# EAGLE design Shruthi-Analog-IR3109-v01 (EAGLE 5.09)
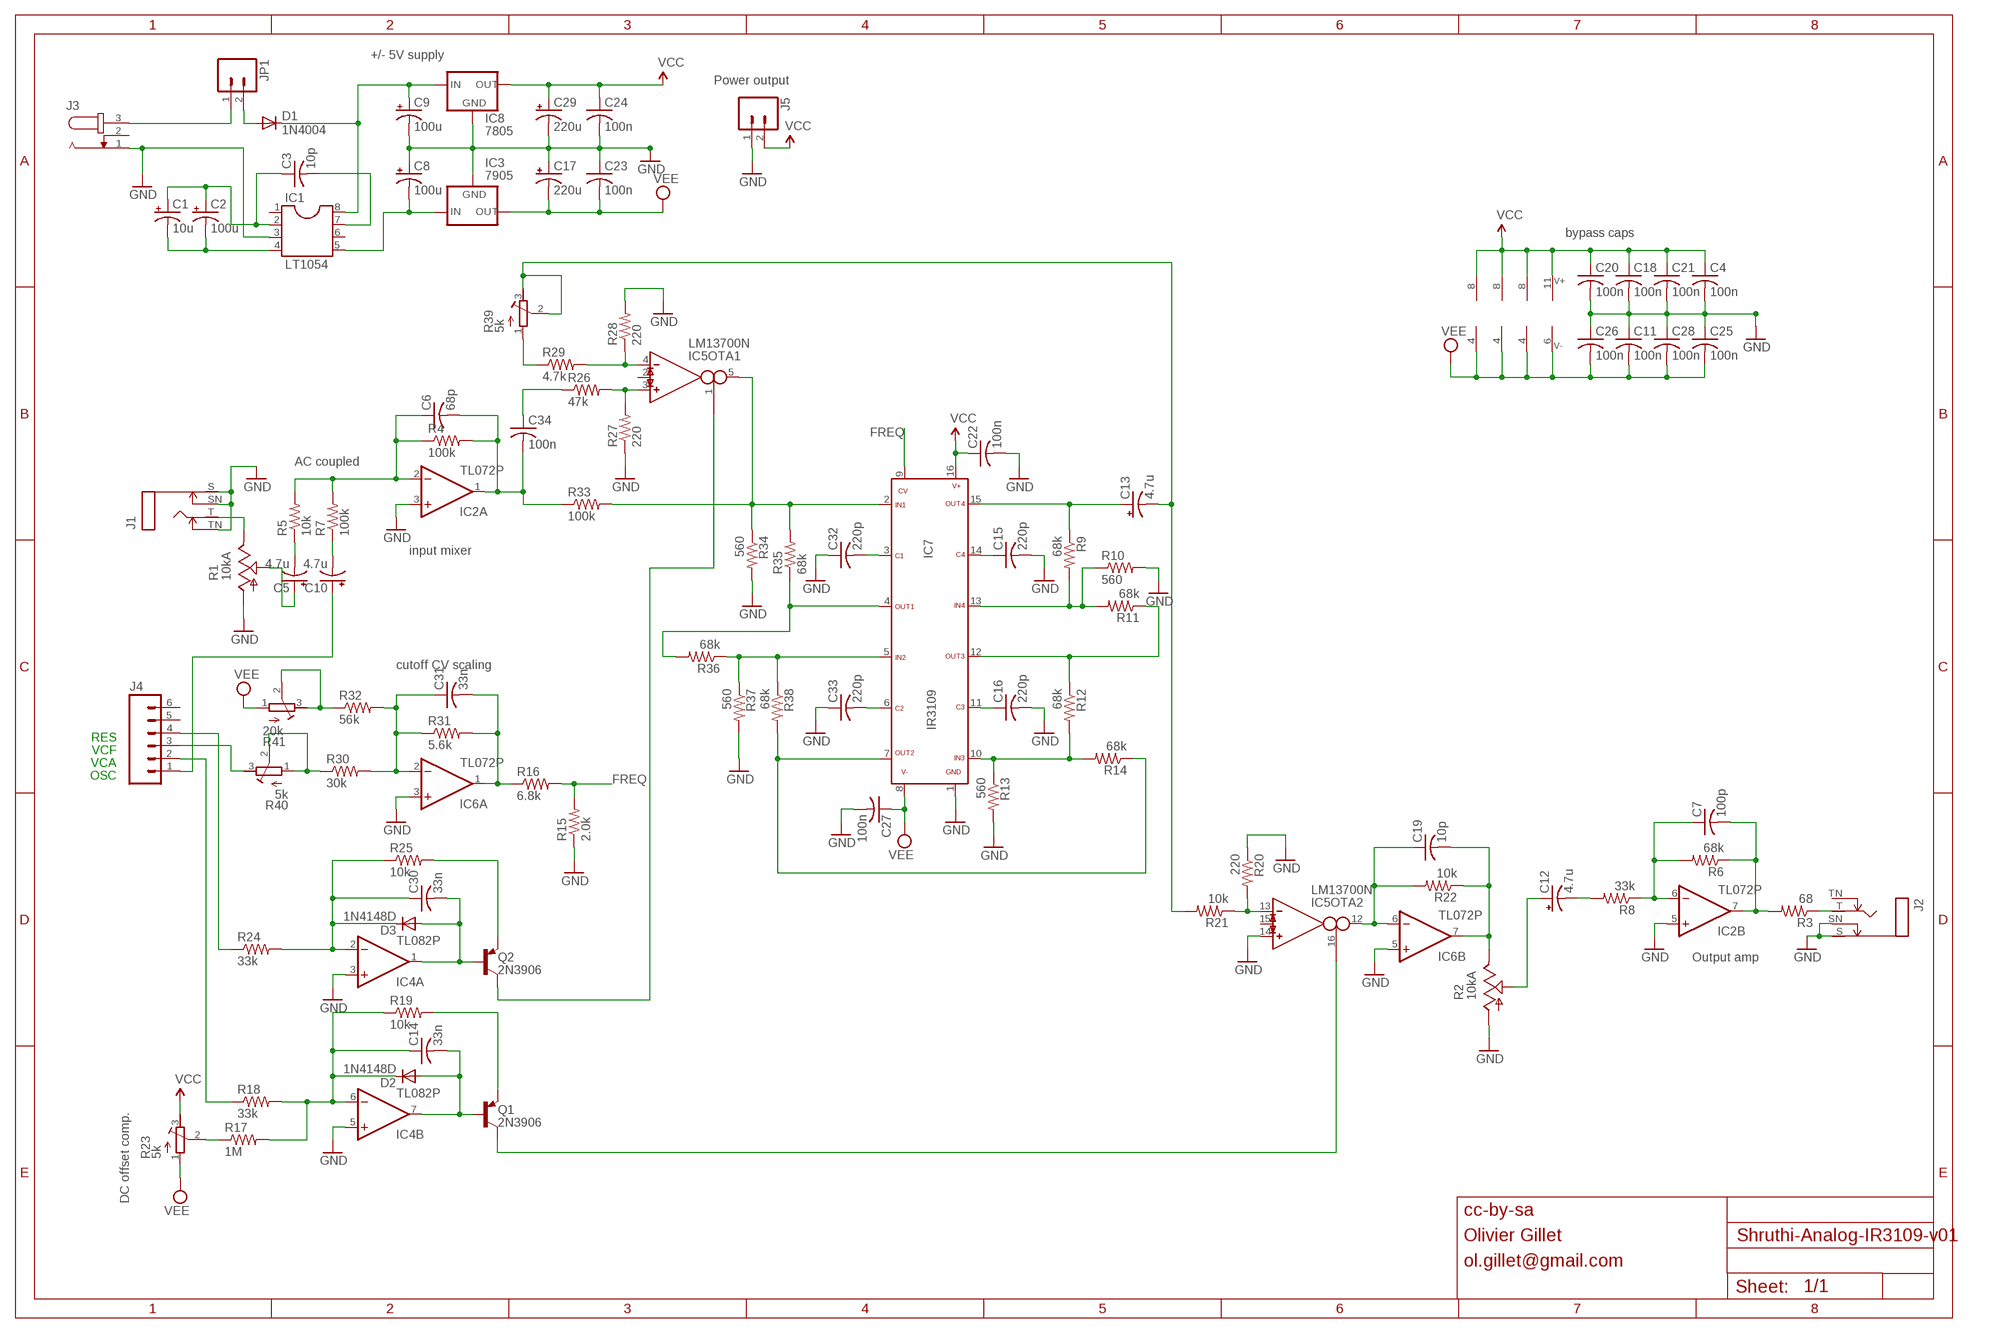
[diagram p0: schematic, sheet 1]

## Parts
C1  10u  CPOL-USE2.5-5  [E2,5-5]
C2  100u  CPOL-USE2.5-6  [E2,5-6]
C3  10p  C-US025-025X050  [C025-025X050]
C4  100n  C-US025-025X050  [C025-025X050]
C5  4.7u  CPOL-USE2.5-6  [E2,5-6]
C6  68p  C-US025-025X050  [C025-025X050]
C7  100p  C-US025-025X050  [C025-025X050]
C8  100u  CPOL-USE2.5-7  [E2,5-7]
C9  100u  CPOL-USE2.5-7  [E2,5-7]
C10  4.7u  CPOL-USE2.5-6  [E2,5-6]
C11  100n  C-US025-025X050  [C025-025X050]
C12  4.7u  CPOL-USE2.5-6  [E2,5-6]
C13  4.7u  CPOL-USE2.5-6  [E2,5-6]
C14  33n  C-US050-025X075  [C050-025X075]
C15  220p  C-US025-040X050  [C025-040X050]
C16  220p  C-US025-040X050  [C025-040X050]
C17  220u  CPOL-USE5-10.5  [E5-10,5]
C18  100n  C-US025-025X050  [C025-025X050]
C19  10p  C-US025-025X050  [C025-025X050]
C20  100n  C-US025-025X050  [C025-025X050]
C21  100n  C-US025-025X050  [C025-025X050]
C22  100n  C-US025-025X050  [C025-025X050]
C23  100n  C-US025-025X050  [C025-025X050]
C24  100n  C-US025-025X050  [C025-025X050]
C25  100n  C-US025-025X050  [C025-025X050]
C26  100n  C-US025-025X050  [C025-025X050]
C27  100n  C-US025-025X050  [C025-025X050]
C28  100n  C-US025-025X050  [C025-025X050]
C29  220u  CPOL-USE5-10.5  [E5-10,5]
C30  33n  C-US050-025X075  [C050-025X075]
C31  33n  C-US050-025X075  [C050-025X075]
C32  220p  C-US025-040X050  [C025-040X050]
C33  220p  C-US025-040X050  [C025-040X050]
C34  100n  C-US025-025X050  [C025-025X050]
D1  1N4004  [DO41-10]
D2  1N4148D  DIODE-D-5  [D-5]
D3  1N4148D  DIODE-D-5  [D-5]
IC1  LT1054  DIL8  [DIL08]
IC2  TL072P  [DIL08]
IC3  7905  79XXS  [79XXS]
IC4  TL082P  TL072P  [DIL08]
IC5  LM13700N  [DIL16]
IC6  TL072P  [DIL08]
IC7  IR3109  [DIL16]
IC8  7805  78XXS  [78XXS]
J1  MONOSWS  [NMJ4HC-S]
J2  MONOSWS  [NMJ4HC-S]
J3  JACK-PLUG1  [SPC4078]
J4  M06SIP  [1X06]
J5  M02PTH  [1X02]
JP1  M02  [1X02_LONGPADS]
Q1  2N3906  2N3906-  [TO92-]
Q2  2N3906  2N3906-  [TO92-]
R1  10kA  POT_USCABLED  [CABLE_POT_6MM]
R2  10kA  POT_USCABLED  [CABLE_POT_6MM]
R3  68  R-US_0204/7  [0204/7]
R4  100k  R-US_0204/7  [0204/7]
R5  10k  R-US_0204/7  [0204/7]
R6  68k  R-US_0204/7  [0204/7]
R7  100k  R-US_0204/7  [0204/7]
R8  33k  R-US_0204/7  [0204/7]
R9  68k  R-US_0204/7  [0204/7]
R10  560  R-US_0204/7  [0204/7]
R11  68k  R-US_0204/7  [0204/7]
R12  68k  R-US_0204/7  [0204/7]
R13  560  R-US_0204/7  [0204/7]
R14  68k  R-US_0204/7  [0204/7]
R15  2.0k  R-US_0204/7  [0204/7]
R16  6.8k  R-US_0204/7  [0204/7]
R17  1M  R-US_0204/7  [0204/7]
R18  33k  R-US_0204/7  [0204/7]
R19  10k  R-US_0204/7  [0204/7]
R20  220  R-US_0204/7  [0204/7]
R21  10k  R-US_0204/7  [0204/7]
R22  10k  R-US_0204/7  [0204/7]
R23  5k  R-TRIMM3296W  [RTRIM3296W]
R24  33k  R-US_0204/7  [0204/7]
R25  10k  R-US_0204/7  [0204/7]
R26  47k  R-US_0204/7  [0204/7]
R27  220  R-US_0204/7  [0204/7]
R28  220  R-US_0204/7  [0204/7]
R29  4.7k  R-US_0204/7  [0204/7]
R30  30k  R-US_0204/7  [0204/7]
R31  5.6k  R-US_0204/7  [0204/7]
R32  56k  R-US_0204/7  [0204/7]
R33  100k  R-US_0204/7  [0204/7]
R34  560  R-US_0204/7  [0204/7]
R35  68k  R-US_0204/7  [0204/7]
R36  68k  R-US_0204/7  [0204/7]
R37  560  R-US_0204/7  [0204/7]
R38  68k  R-US_0204/7  [0204/7]
R39  5k  R-TRIMM3296W  [RTRIM3296W]
R40  5k  R-TRIMM3296W  [RTRIM3296W]
R41  20k  R-TRIMM3296W  [RTRIM3296W]

## Nets
FREQ: IC7.9 R15.2 R16.2
GND: C4.2 C8.+ C9.- C11.1 C15.2 C16.2 C17.+ C18.2 C20.2 C21.2 C22.2 C23.1 C24.2 C25.1 C26.1 C27.2 C28.1 C29.- C32.1 C33.1 IC1.3 IC2.3(A:+IN) IC2.5(B:+IN) IC3.GND IC4.3(A:+IN) IC4.5(B:+IN) IC5.14(OTA2:IN_P) IC6.3(A:+IN) IC6.5(B:+IN) IC7.1 IC8.GND J1.S J1.SN J1.TN J2.S J2.SN J3.1 J5.1 R1.A R2.A R10.2 R13.2 R15.1 R20.1 R27.1 R28.2 R34.2 R37.2
I_RESO: IC5.1(OTA1:I_BIAS) Q2.1(C)
N$1: C1.+ C2.+ C3.1 IC1.2
N$2: C16.1 IC7.11
N$3: J3.3 JP1.1
N$4: C9.+ D1.C IC1.8 IC8.IN
N$5: C1.- C2.- IC1.4
N$6: C31.2 IC6.1(A:OUT) R16.1 R31.2
N$7: IC5.4(OTA1:IN_N) R28.1 R29.2
N$8: C32.2 IC7.3
N$9: IC5.13(OTA2:IN_N) R20.2 R21.1
N$10: IC5.3(OTA1:IN_P) R26.2 R27.2
N$11: C13.+ IC7.15 R9.1
N$12: IC5.5(OTA1:OUT) IC7.2 R33.2 R34.1 R35.2
N$13: IC7.4 R35.1 R36.2
N$14: IC7.5 R36.1 R37.1 R38.1
N$16: IC7.7 R14.1 R38.2
N$17: C33.2 IC7.6
N$18: IC7.12 R11.1 R12.1
N$19: C12.+ R2.S
N$20: IC7.10 R12.2 R13.1 R14.2
N$21: C15.1 IC7.14
N$22: C6.2 C34.2 IC2.1(A:OUT) R4.2 R33.1
N$23: R29.1 R39.1(E)
N$24: IC7.13 R9.2 R10.1 R11.2
N$25: C12.- R8.2
N$26: C13.- R21.2 R39.2(S) R39.3(A)
N$27: C19.1 IC5.12(OTA2:OUT) IC6.6(B:-IN) R22.2
N$28: C19.2 IC6.7(B:OUT) R2.E R22.1
N$29: C34.1 R26.1
N$30: C30.2 D3.A IC4.1(A:OUT) Q2.2(B)
N$31: C14.2 D2.A IC4.7(B:OUT) Q1.2(B)
N$35: C10.+ J4.1
N$36: C3.2 IC1.7
N$37: C6.1 IC2.2(A:-IN) R4.1 R5.2 R7.2
N$38: J1.T R1.E
N$39: C10.- R7.1
N$40: C31.1 IC6.2(A:-IN) R30.2 R31.1 R32.2
N$41: R30.1 R40.1(E) R40.2(S)
N$42: J4.3 R40.3(A)
N$43: R32.1 R41.2(S) R41.3(A)
N$45: J4.2 R18.1
N$47: J2.T R3.1
N$48: J4.4 R24.1
N$50: R17.1 R23.2(S)
N$51: C14.1 D2.C IC4.6(B:-IN) R17.2 R18.2 R19.1
N$57: C30.1 D3.C IC4.2(A:-IN) R24.2 R25.1
N$58: C8.- IC1.5 IC3.IN
N$59: D1.A JP1.2
N$60: Q2.3(E) R25.2
N$63: C7.2 IC2.7(B:OUT) R3.2 R6.1
N$65: IC5.16(OTA2:I_BIAS) Q1.1(C)
N$66: C5.+ R1.S
N$68: Q1.3(E) R19.2
N$70: C7.1 IC2.6(B:-IN) R6.2 R8.1
N$72: C5.- R5.1
VCC: C4.1 C18.1 C20.1 C21.1 C22.1 C24.1 C29.+ IC2.8(P:V+) IC4.8(P:V+) IC5.11(SUPPLY:V+) IC6.8(P:V+) IC7.16 IC8.OUT J5.2 R23.3(A)
VEE: C11.2 C17.- C23.2 C25.2 C26.2 C27.1 C28.2 IC2.4(P:V-) IC3.OUT IC4.4(P:V-) IC5.6(SUPPLY:V-) IC6.4(P:V-) IC7.8 R23.1(E) R41.1(E)
Unconnected: IC1.1 IC1.6 IC5.2(OTA1:I_DIODE) IC5.7(BUF1:B) IC5.8(BUF1:E) IC5.9(BUF2:E) IC5.10(BUF2:B) IC5.15(OTA2:I_DIODE) J2.TN J3.2 J4.5 J4.6

## Notes on the sheet
- +/- 5V supply
- Power output
- bypass caps
- AC coupled
- input mixer
- cutoff CV scaling
- RES
- VCF
- VCA
- OSC
- Output amp
- DC offset comp.
- cc-by-sa
- Olivier Gillet
- ol.gillet@gmail.com

## Library data of the parts
C1 C2 C5 C8-C10 C12 C13 C17 C29 = rcl:CPOL-US: POLARIZED CAPACITOR, American symbol
C3 C4 C6 C7 C11 C14-C16 C18-C28 C30-C34 = rcl:C-US: CAPACITOR, American symbol
D1 = diode:1N4004: DIODE general purpose rectifier, 1 A
D2 D3 = diode:DIODE-: DIODE
IC1 = ic-package:DIL8: Dual In Line / Socket
IC2 IC4 IC6 = gm-ics:TL072: OP AMP
IC3 = v-reg:79XXS: VOLTAGE REGULATOR
IC5 = ota:LM13700: Dual OTA with buffers
IC7 = og-roland:IR3109: 4-pole VCF with VC-controlled resonance
IC8 = v-reg:78XXS: VOLTAGE REGULATOR
J1 J2 = gm-jacks:MONOSW
J3 = con-jack2:JACK-PLUG: DC POWER JACK Power Jack, DC, Right Angle, Through Hole, Rated 5A at 16VDC, PC Terminals Distributor: Farnell (www.Farnell.de) Drawing: 84N1161.pdf / 84N1162.pdf Manufacturer: SPC Technology (www.spctechnology.com) Type: SPC4077 / SPC 4078
J4 = SparkFun:M06: Header 6 Standard 6-pin 0.1" header. Use with straight break away headers (SKU : PRT-00116), right angle break away headers (PRT-00553), swiss pins (PRT-00743), machine pins (PRT-00117), and female headers (PRT-00115). Molex polarized connector foot print use with SKU : PRT-08094 with associated crimp pins and housings. NOTES ON THE VARIANTS LOCK and LOCK_LONGPADS... This footprint was designed to help hold the alignment of a through-hole component (i.e. 6-pin header) while soldering it into place. You may notice that each hole has been shifted either up or down by 0.005 of an inch from it's more standard position (which is a perfectly straight line). This slight alteration caused the pins (the squares in the middle) to touch the edges of the holes. Because they are alternating, it causes a "brace" to hold the component in place. 0.005 has proven to be the perfect amount of "off-center" position when using our standard breakaway headers. Although looks a little odd when you look at the bare footprint, once you have a header in there, the alteration is very hard to notice. Also, if you push a header all the way into place, it is covered up entirely on the bottom side. This idea of altering the position of holes to aid alignment will be further integrated into the Sparkfun Library for other footprints. It can help hold any component with 3 or more connection pins.
J5 JP1 = SparkFun:M02: Header 2 Standard 2-pin 0.1" header. Use with straight break away headers (SKU : PRT-00116), right angle break away headers (PRT-00553), swiss pins (PRT-00743), machine pins (PRT-00117), and female headers (PRT-00115). Molex polarized connector foot print use with SKU : PRT-08233 with associated crimp pins and housings.
Q1 Q2 = gm-trans:2N3906: PNP Transistor
R1 R2 = pot-cable:POT_US
R3-R22 R24-R38 = rcl:R-US_: RESISTOR, American symbol
R23 R39-R41 = rcl:R-TRIMM: Trimm resistor

## Board
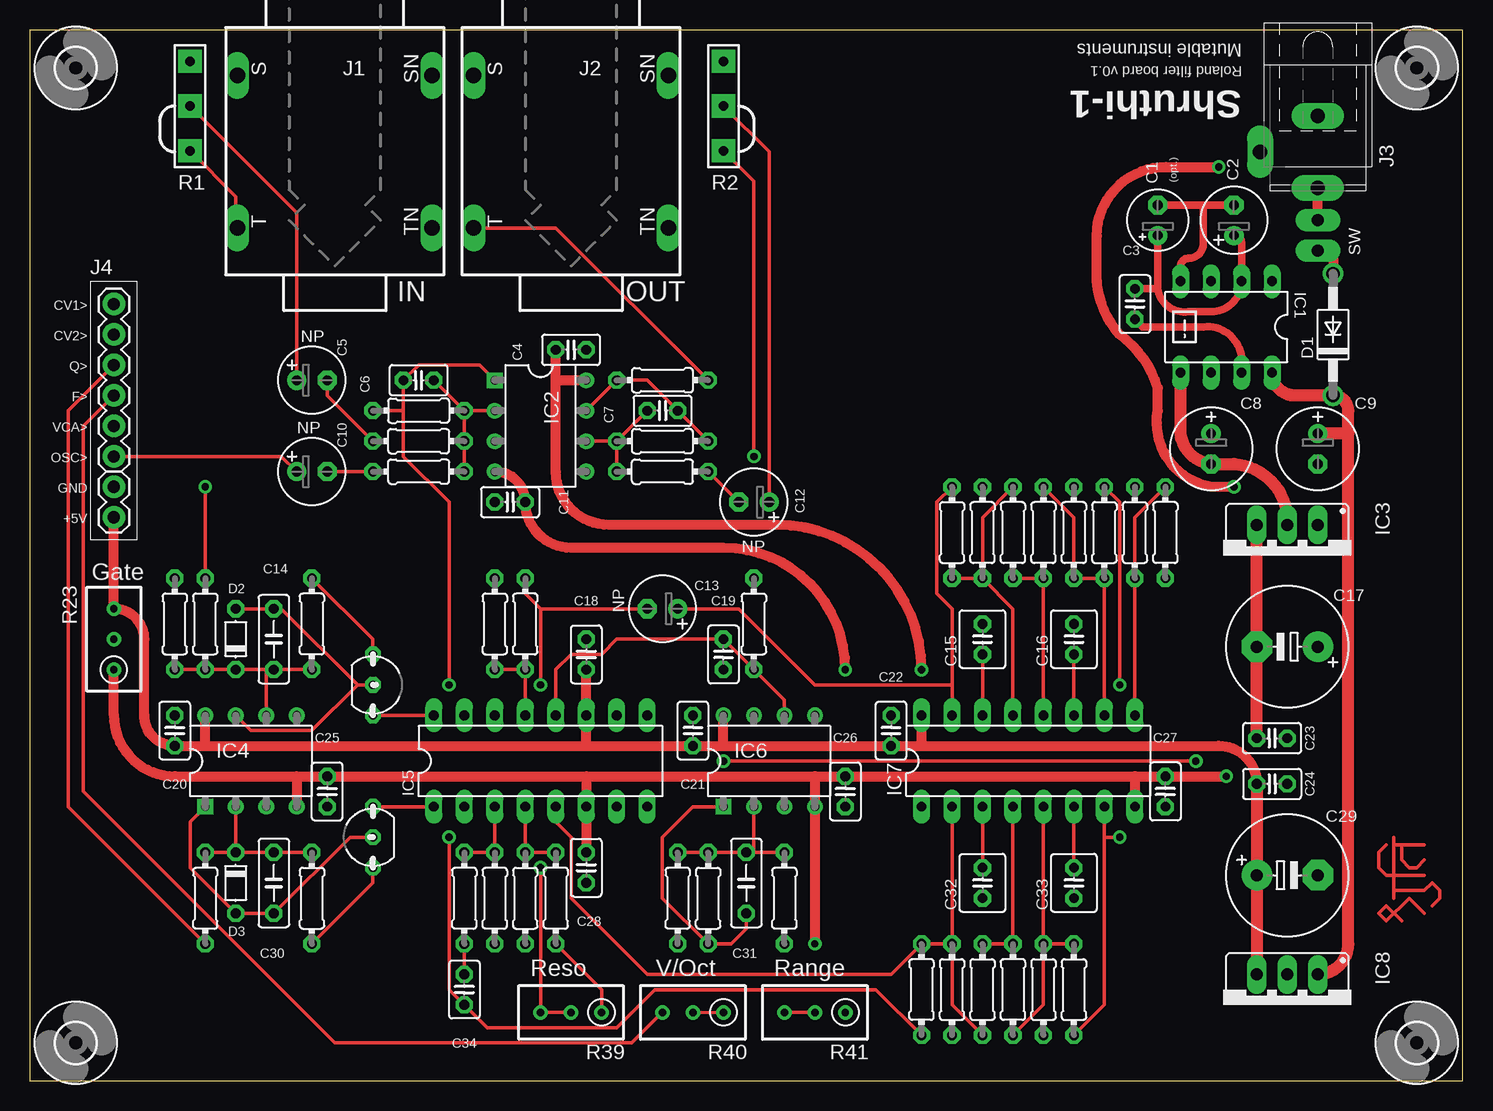
[diagram p1: board, top side]
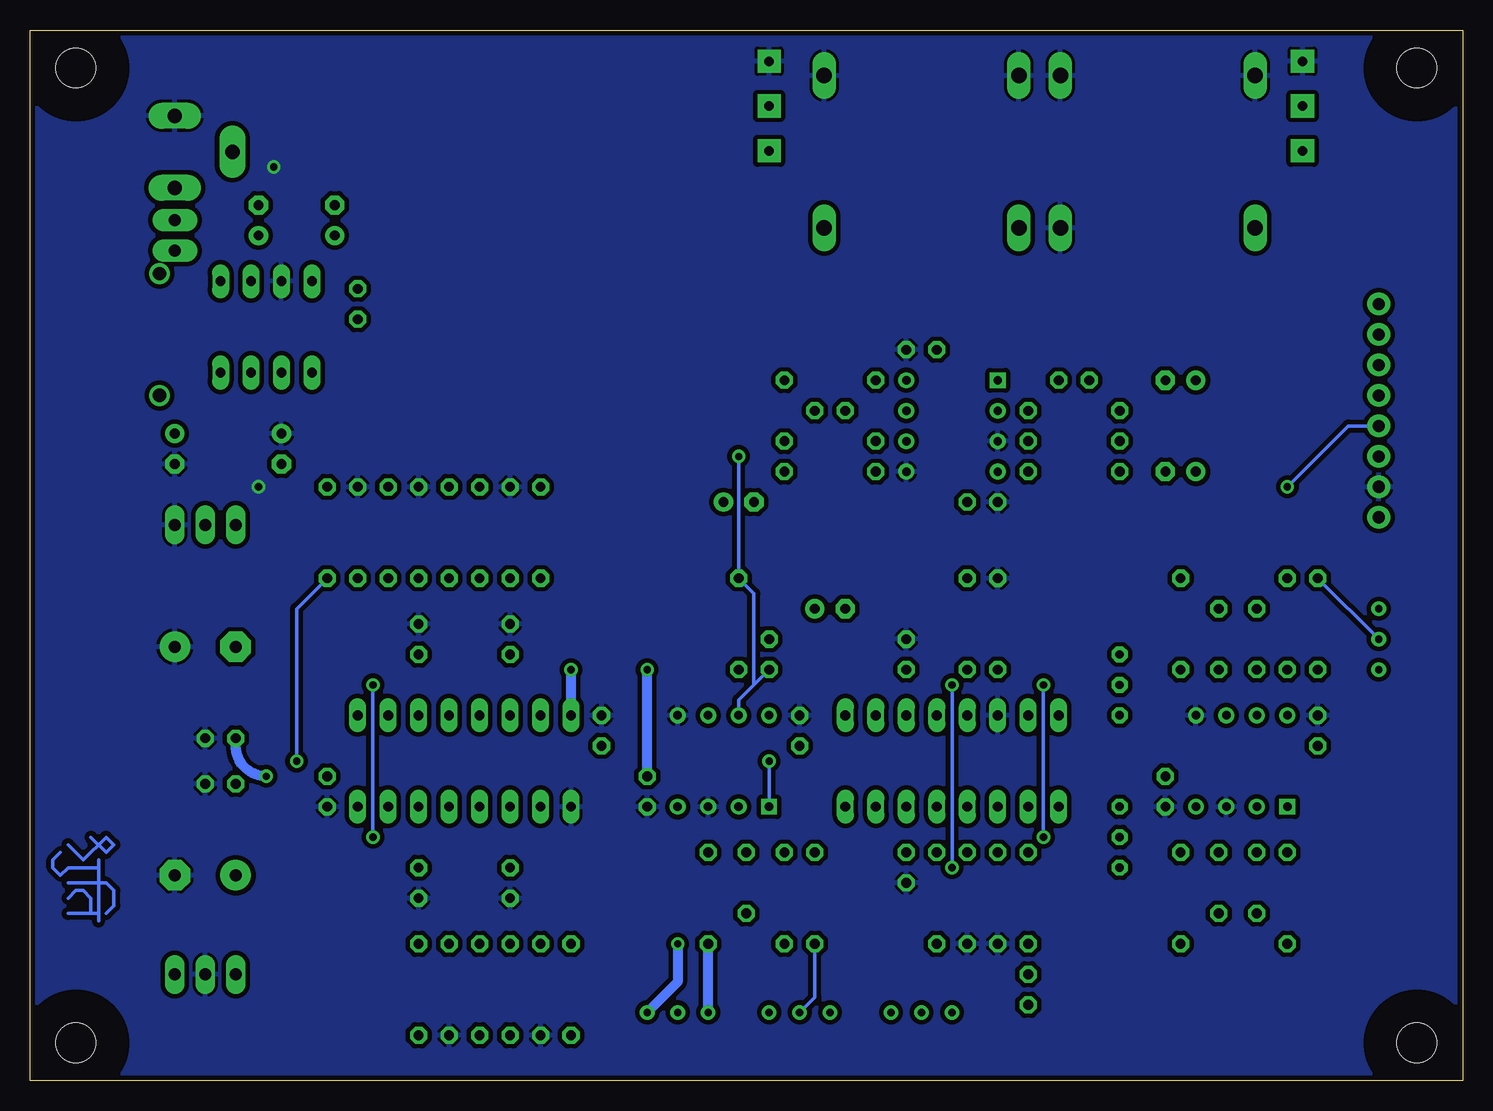
[diagram p2: board, bottom side, seen from below]

Size 119.38 x 87.62 mm. Coordinates in mm from the lower left corner, seen from the top.
Outline: 0,0 119.38,0 119.38,87.62 0,87.62 0,0
Copper layers (1*16): Top 0.035mm / dielectric 1.5mm / Bottom 0.035mm
Design rules "SparkFun_10mil *": minimum track width 10mil, minimum drill 20mil, track to track 10mil, track to pad 10mil, pad to pad 10mil, via to via 10mil, smd to smd 10mil, copper to edge 10mil, drill to drill 10mil, minimum pad ring 12mil, minimum via ring 10mil, stop-mask expansion 4mil, vias tented up to drill 25mil, thermal gap 10mil

### Footprints (pad centres in the part's own frame; a part is rotated, then mirrored left to right if it is on the bottom)
E2,5-5 = drill 0.813 pad 1.6 round: + -1.27,0 | drill 0.813 pad 1.6 octagon: - 1.27,0
E2,5-6 = drill 0.813 pad 1.6 round: + -1.27,0 | drill 0.813 pad 1.6 octagon: - 1.27,0
C025-025X050 = drill 0.813 octagon: 1 -1.27,0; 2 1.27,0
E2,5-7 = drill 0.813 pad 1.6 round: + -1.27,0 | drill 0.813 pad 1.6 octagon: - 1.27,0
C050-025X075 = drill 0.813 octagon: 1 -2.54,0; 2 2.54,0
C025-040X050 = drill 0.813 octagon: 1 -1.27,0; 2 1.27,0
E5-10,5 = drill 1.016 pad 2.54 round: + -2.54,0 | drill 1.016 pad 2.54 octagon: - 2.54,0
DO41-10 = drill 1.118 round: A 5.08,0; C -5.08,0
D-5 = drill 0.813 octagon: A 2.54,0; C -2.54,0
DIL08 = drill 0.813 long: 1 -3.81,-3.81; 2 -1.27,-3.81; 3 1.27,-3.81; 4 3.81,-3.81; 5 3.81,3.81; 6 1.27,3.81; 7 -1.27,3.81; 8 -3.81,3.81
DIL08' = drill 0.7 square: 1 -3.81,-3.81 | drill 0.7 round: 2 -1.27,-3.81; 3 1.27,-3.81; 4 3.81,-3.81; 5 3.81,3.81; 6 1.27,3.81; 7 -1.27,3.81; 8 -3.81,3.81
79XXS = drill 1.016 long: GND -2.54,-2.54; IN 0,-2.54; OUT 2.54,-2.54
DIL16 = drill 0.813 long: 1 -8.89,-3.81; 2 -6.35,-3.81; 3 -3.81,-3.81; 4 -1.27,-3.81; 5 1.27,-3.81; 6 3.81,-3.81; 7 6.35,-3.81; 8 8.89,-3.81; 9 8.89,3.81; 10 6.35,3.81; 11 3.81,3.81; 12 1.27,3.81; 13 -1.27,3.81; 14 -3.81,3.81; 15 -6.35,3.81; 16 -8.89,3.81
78XXS = drill 1.016 long: GND 0,-2.54; IN -2.54,-2.54; OUT 2.54,-2.54
NMJ4HC-S = drill 1.3 long: S 5.08,8.115; SN 5.08,-8.115; T -7.62,8.115; TN -7.62,-8.115
SPC4078_LARGER_HOLES = drill 1.2 pad 2.184 long: 1 -3,0; 2 0,-4.8; 3 3,0
1X06 = drill 1.016 pad 1.88 round: 1 0,0; 2 2.54,0; 3 5.08,0; 4 7.62,0; 5 10.16,0; 6 12.7,0
1X02 = drill 1.016 pad 1.88 round: 1 0,0; 2 2.54,0
1X02_LONGPADS = drill 1.016 pad 1.88 long: 1 0,0; 2 2.54,0
TO92- = drill 0.7 octagon: 1 2.54,0; 2 0,0; 3 -2.54,0
CABLE_POT_6MM = drill 0.8 pad 1.93 square: A -3.73,0; E 3.73,0; S 0,0
0204/7 = drill 0.813 octagon: 1 -3.81,0; 2 3.81,0
RTRIM3296W = drill 0.61 round: 1 0,-2.54; 2 0,0; 3 0,2.54
3,3 = hole 3.3: 0,0

### Placement (x,y rotation side)
C1  93.98,71.75 90 top
C2  100.33,71.75 90 top
C3  92.08,64.77 270 top
C4  45.09,60.96 0 top
C5  23.5,58.42 0 top
C6  32.38,58.42 180 top
C7  52.7,55.88 0 top
C8  98.42,52.71 270 top
C9  107.31,52.71 270 top
C10  23.5,50.8 0 top
C11  40.01,48.26 0 top
C12  60.33,48.26 180 top
C13  52.7,39.37 180 top
C14  20.32,36.83 90 top
C15  79.38,36.83 90 top
C16  87,36.83 90 top
C17  104.78,36.2 180 top
C18  46.35,35.56 90 top
C19  57.78,35.56 270 top
C20  12.07,29.21 90 top
C21  55.24,29.21 90 top
C22  71.75,29.21 90 top
C23  103.5,28.57 180 top
C24  103.5,24.76 0 top
C25  24.77,24.13 90 top
C26  67.95,24.13 90 top
C27  94.61,24.13 270 top
C28  46.35,17.78 90 top
C29  104.78,17.14 0 top
C30  20.32,16.51 270 top
C31  59.69,16.51 270 top
C32  79.38,16.51 90 top
C33  87,16.51 90 top
C34  36.2,7.62 270 top
D1  108.58,62.23 90 top
D2  17.14,36.83 90 top
D3  17.14,16.51 270 top
IC1  99.69,62.87 180 top
IC2  TL072P  [DIL08']  42.55,54.61 270 top
IC3  104.78,43.82 180 top
IC4  TL082P  [DIL08']  18.41,26.67 0 top
IC5  42.55,26.67 0 top
IC6  TL072P  [DIL08']  61.59,26.67 0 top
IC7  83.19,26.67 0 top
IC8  104.78,6.35 180 top
J1  25.4,78.74 90 top
J2  45.09,78.74 90 top
J3  [SPC4078_LARGER_HOLES]  107.31,77.47 270 top
J4  6.99,52.07 90 top
J5  6.99,49.53 270 top
JP1  107.31,71.75 270 top
Q1  28.57,33.02 270 top
Q2  28.57,20.32 90 top
R1  13.34,81.28 270 top
R2  57.78,81.28 270 top
R3  52.7,58.42 180 top
R4  32.38,55.88 180 top
R5  32.38,53.34 0 top
R6  52.7,53.34 180 top
R7  32.38,50.8 0 top
R8  52.7,50.8 0 top
R9  76.83,45.72 270 top
R10  79.38,45.72 90 top
R11  81.92,45.72 90 top
R12  84.45,45.72 90 top
R13  87,45.72 90 top
R14  89.53,45.72 270 top
R15  92.08,45.72 270 top
R16  94.61,45.72 90 top
R17  12.07,38.1 270 top
R18  14.61,38.1 270 top
R19  23.5,38.1 90 top
R20  38.73,38.1 270 top
R21  41.27,38.1 90 top
R22  60.33,38.1 270 top
R23  6.99,36.83 0 top
R24  14.61,15.24 90 top
R25  23.5,15.24 270 top
R26  36.2,15.24 90 top
R27  38.73,15.24 90 top
R28  41.27,15.24 270 top
R29  43.81,15.24 90 top
R30  53.98,15.24 90 top
R31  56.52,15.24 270 top
R32  62.87,15.24 90 top
R33  74.3,7.62 90 top
R34  76.83,7.62 270 top
R35  79.38,7.62 270 top
R36  81.92,7.62 90 top
R37  84.45,7.62 270 top
R38  87,7.62 270 top
R39  45.09,5.71 90 top
R40  55.24,5.71 90 top
R41  65.41,5.71 90 top
U$1  [RADHA]  86.36,87.63 180 top
U$2  [3,3]  3.81,84.45 0 top
U$3  [3,3]  115.57,84.45 0 top
U$4  [3,3]  3.81,3.17 0 top
U$5  [3,3]  115.57,3.17 0 top

### Tracks (layer width: path | path; a pad name or v marks a point on that pad's centre or on a via)
FREQ
  Top 0.305: IC7.9 R15.2 92.08,46.99 R16.2
GND  (via drill 0.6)
  Top 0.813: v99.06,76.2 94.65,76.2 arc90 88.9,70.45 88.9,66.67 arc37 90.8,62.23 arc-37 93.98,57.79 93.98,55.88 arc90 98.42,49.53 v100.33,49.53
  pour Bottom (isolate 0.381): 0.64,87 0.64,0.64 118.75,0.64 118.75,87
I_RESO
  Top 0.305: Q2.1 IC5.1
N$1
  Top 0.61: C2.+ arc-90 100.97,69.85 IC1.2 arc-90 98.42,64.14 96.52,64.14 arc-90 93.98,66.04 | 93.98,66.04 C1.+ | C3.1 93.98,66.04
N$2
  Top 0.305: IC7.11 C16.1
N$3
  Top 0.813: JP1.1 J3.3
N$4
  Top 1.016: IC8.IN arc90 109.86,11.43 109.86,53.98 | 109.86,53.98 109.86,55.88 arc90 D1.C 105.41,57.15 arc-90 IC1.8 | 109.86,53.98 C9.+
N$5
  Top 0.61: 97.79,73.03 C1.- | 97.79,73.03 C2.- | IC1.4 95.89,67.95 arc-90 96.52,68.58 arc90 97.79,69.85 97.79,73.03
N$6  (via drill 0.6)
  Top 0.305: C31.2 59.69,12.7 58.42,11.43 R31.2 52.7,15.24 52.7,20.32 55.24,22.86 IC6.1 | v57.78,26.67 v97.16,26.67
  Bottom 0.305: IC6.1 v57.78,26.67 | v97.16,26.67 97.16,39.37 R16.1
N$7
  Top 0.305: IC5.4 R28.1 R29.2
N$8
  Top 0.305: C32.2 IC7.3
N$9
  Top 0.305: R20.2 R21.1 IC5.13
N$10
  Top 0.305: R26.2 R27.2 IC5.3
N$11
  Top 0.305: 76.83,33.02 76.83,39.37 75.56,40.64 75.56,48.26 R9.1 | 76.83,33.02 IC7.15 | C13.+ 59.05,39.37 65.41,33.02 76.83,33.02
N$12
  Top 0.305: R34.1 IC7.2 | R34.1 R33.2 71.75,8.89 51.44,8.89 45.09,15.24 45.09,20.32 43.81,21.59 IC5.5 | R34.1 76.83,6.35 R35.2
N$13
  Top 0.305: IC7.4 R36.2 R35.1
N$14
  Top 0.305: R36.1 84.45,6.35 R37.1 | R37.1 R38.1 | R37.1 IC7.5
N$15
  Bottom 0.305: 116.2,19.68 114.94,18.41 113.03,20.32 112.39,19.68 113.03,19.05 114.3,20.32
N$16  (via drill 0.6)
  Top 0.305: R38.2 89.53,6.35 89.53,20.32 | 89.53,20.32 IC7.7 | R14.1 90.8,48.26 v90.8,33.02 | 89.53,20.32 v90.8,20.32
  Bottom 0.305: v90.8,20.32 v90.8,33.02
N$17
  Top 0.305: C33.2 IC7.6
N$18
  Top 0.305: R11.1 R12.1 IC7.12
N$19
  Top 0.305: R2.S 61.59,77.47 C12.+
N$20
  Top 0.305: R12.2 87,46.99 R13.1 R14.2 IC7.10
N$21
  Top 0.305: IC7.14 C15.1
N$22  (via drill 0.6)
  Top 0.305: IC2.1 37.47,59.69 32.38,59.69 C6.2 31.11,55.88 | v34.93,33.02 34.93,48.26 31.11,52.07 31.11,55.88 | 31.11,55.88 R4.2 | R33.1 70.48,7.62 52.07,7.62 48.89,4.45 38.1,4.45 C34.2 34.93,7.62 v34.93,20.32
  Bottom 0.305: v34.93,20.32 v34.93,33.02
N$23
  Top 0.305: R29.1 47.62,7.62 R39.1
N$24
  Top 0.305: R10.1 R9.2 | IC7.13 81.92,39.37 R10.1 | R10.1 79.38,46.99 R11.2
N$25
  Top 0.305: C12.- R8.2
N$26  (via drill 0.6)
  Top 0.305: 42.55,39.37 41.27,40.64 R21.2 | 42.55,39.37 C13.- | v42.55,33.02 42.55,39.37 | v42.55,17.78 R39.3 R39.2
  Bottom 0.305: v42.55,17.78 v42.55,33.02
N$27
  Top 0.305: IC6.6 62.87,31.75 R22.2 C19.1 48.89,36.83 47.62,35.56 45.09,35.56 43.81,34.29 IC5.12
N$28  (via drill 0.6)
  Top 0.305: R2.E 60.33,75.01 v60.33,52.07
  Bottom 0.305: v60.33,52.07 R22.1 59.05,40.64 59.05,33.02 | 59.05,33.02 60.33,31.75 IC6.7 | 59.05,33.02 C19.2
N$29
  Top 0.305: C34.1 R26.1
N$30
  Top 0.305: IC4.1 13.34,21.59 13.34,17.78 D3.A C30.2 26.67,20.32 Q2.2
N$31
  Top 0.305: 27.3,33.02 Q1.2 | IC4.7 18.41,29.21 23.5,29.21 27.3,33.02 | 27.3,33.02 20.96,39.37 C14.2 D2.A
N$35
  Top 0.305: J4.1 20.96,52.07 C10.+
N$36
  Top 0.61: IC1.7 100.97,60.33 arc90 97.79,62.87 92.71,62.87 C3.2
N$37
  Top 0.305: R4.1 C6.1 | R4.1 R5.2 R7.2 | R4.1 IC2.2
N$38
  Top 0.305: R1.E 17.14,73.74 17.14,71.12 J1.T
N$39
  Top 0.305: C10.- R7.1
N$40
  Top 0.305: R30.2 R31.1 C31.1 60.33,19.05 | 60.33,19.05 R32.2 | 60.33,19.05 IC6.2
N$41
  Top 0.254: R40.2 R40.1
  Bottom 0.305: R40.2 53.98,6.98 R30.1
N$42
  Top 0.305: J4.3 4.45,54.61 4.45,24.13 25.4,3.17 50.16,3.17 R40.3
N$43
  Top 0.305: R41.3 R41.2
  Bottom 0.813: R41.3 R32.1
N$45  (via drill 0.6)
  Top 0.305: R18.1 v14.61,49.53
  Bottom 0.305: v14.61,49.53 9.53,54.61 J4.2
N$47
  Top 0.305: R3.1 43.81,71.12 J2.T
N$48
  Top 0.305: J4.4 3.18,55.88 3.18,22.86 R24.1
N$50
  Bottom 0.305: R23.2 R17.1
N$51
  Top 0.305: R17.2 R18.2 D2.C 19.68,34.29 | 19.68,34.29 C14.1 R19.1 | 19.68,34.29 IC4.6
N$52
  Bottom 0.305: 113.67,17.78 113.67,18.41 | 113.67,16.51 113.67,17.78 | 113.67,16.51 113.67,13.97 | 113.67,13.97 113.67,13.34 | 114.3,13.97 116.2,13.97 | 113.67,13.97 114.3,13.97 | 114.3,13.97 114.3,15.24 114.94,15.88 115.57,15.88 116.2,15.24 | 113.67,17.78 116.2,17.78 116.84,17.14 117.47,17.78 117.47,18.41 116.84,19.05 | 113.67,16.51 116.2,16.51 | 113.67,16.51 113.03,16.51 112.39,15.88 112.39,14.61 113.03,13.97
N$53
  Top 0.305: 116.2,13.97 114.94,15.24 113.03,13.34 112.39,13.97 113.03,14.61 114.3,13.34
N$54
  Top 0.305: 113.67,15.88 113.67,15.24 | 113.67,17.14 113.67,15.88 | 113.67,17.14 113.67,19.68 | 113.67,19.68 113.67,20.32 | 114.3,19.68 116.2,19.68 | 113.67,19.68 114.3,19.68 | 114.3,19.68 114.3,18.41 114.94,17.78 115.57,17.78 116.2,18.41 | 113.67,15.88 116.2,15.88 116.84,16.51 117.47,15.88 117.47,15.24 116.84,14.61 | 113.67,17.14 116.2,17.14 | 113.67,17.14 113.03,17.14 112.39,17.78 112.39,19.05 113.03,19.68
N$57
  Top 0.305: D3.C IC4.2 | R24.2 D3.C | D3.C C30.1 R25.1
N$58
  Top 1.016: IC1.5 95.89,54.61 arc90 C8.- 100.33,51.44 arc-90 IC3.IN
N$59
  Top 0.813: JP1.2 arc-90 108.58,68.58 D1.A
N$60
  Top 0.305: R25.2 28.57,16.51 Q2.3
N$63
  Top 0.305: IC2.7 R3.2 51.44,58.42 C7.2 R6.1
N$65
  Top 0.305: Q1.1 IC5.16
N$66
  Top 0.305: R1.S 22.23,72.39 C5.+
N$68
  Top 0.305: Q1.3 28.57,36.83 R19.2
N$70
  Top 0.305: R6.2 C7.1 | R8.1 R6.2 | R6.2 IC2.6
N$72
  Top 0.305: C5.- 24.77,57.15 R5.1
VCC  (via drill 0.6)
  Top 0.61: IC8.OUT C29.+
  Top 0.813: C24.1 arc90 99.06,27.94 74.3,27.94 | 74.3,27.94 C22.1 57.78,27.94 | 57.78,27.94 C21.1 46.35,27.94 | 14.61,27.94 C20.1 arc-90 9.53,30.48 9.53,36.83 arc90 R23.3 J5.2 | 14.61,27.94 46.35,27.94 | C18.1 IC5.11 46.35,27.94 | 14.61,27.94 IC4.8 | 57.78,27.94 IC6.8 | 74.3,27.94 IC7.16 | v74.3,34.29 arc90 62.23,46.36 48.26,46.36 arc-90 43.81,50.8 43.81,58.42 | 43.81,58.42 C4.1 | 43.81,58.42 IC2.8
  Top 1.016: C24.1 IC8.OUT
  Bottom 0.813: IC7.16 v74.3,34.29
VEE  (via drill 0.6)
  Top 0.813: 92.08,25.4 C26.2 65.41,25.4 | 92.08,25.4 C27.1 v99.69,25.4 | 46.35,25.4 C25.2 22.23,25.4 | 46.35,25.4 65.41,25.4 | 46.35,25.4 IC5.6 C28.2 | 65.41,25.4 IC6.4 v65.41,11.43 | 92.08,25.4 IC7.8 | 22.23,25.4 12.07,25.4 arc-90 6.99,30.48 R23.1 | 22.23,25.4 IC4.4 | IC2.4 arc-90 C11.2 arc90 45.09,44.45 57.78,44.45 arc-90 v67.95,34.29
  Top 1.016: C23.2 C17.- IC3.OUT
  Bottom 0.813: v99.69,25.4 arc90 102.23,27.94 C23.2 | C26.2 v67.95,34.29 | v65.41,11.43 65.41,8.26 R41.1

### Text on the board
tPlace: Mutable instruments | CV1> | CV2> | Q> | F> | VCA> | OSC> | GND | +5V
tNames: Roland filter board v0.1 | Shruthi-1 | (opt.) | SW | IN | OUT | NP | NP | NP | Gate | NP | Reso | V/Oct | Range